# EAGLE design 8x8-LED-Matrix-No-Mode (EAGLE 5.11)
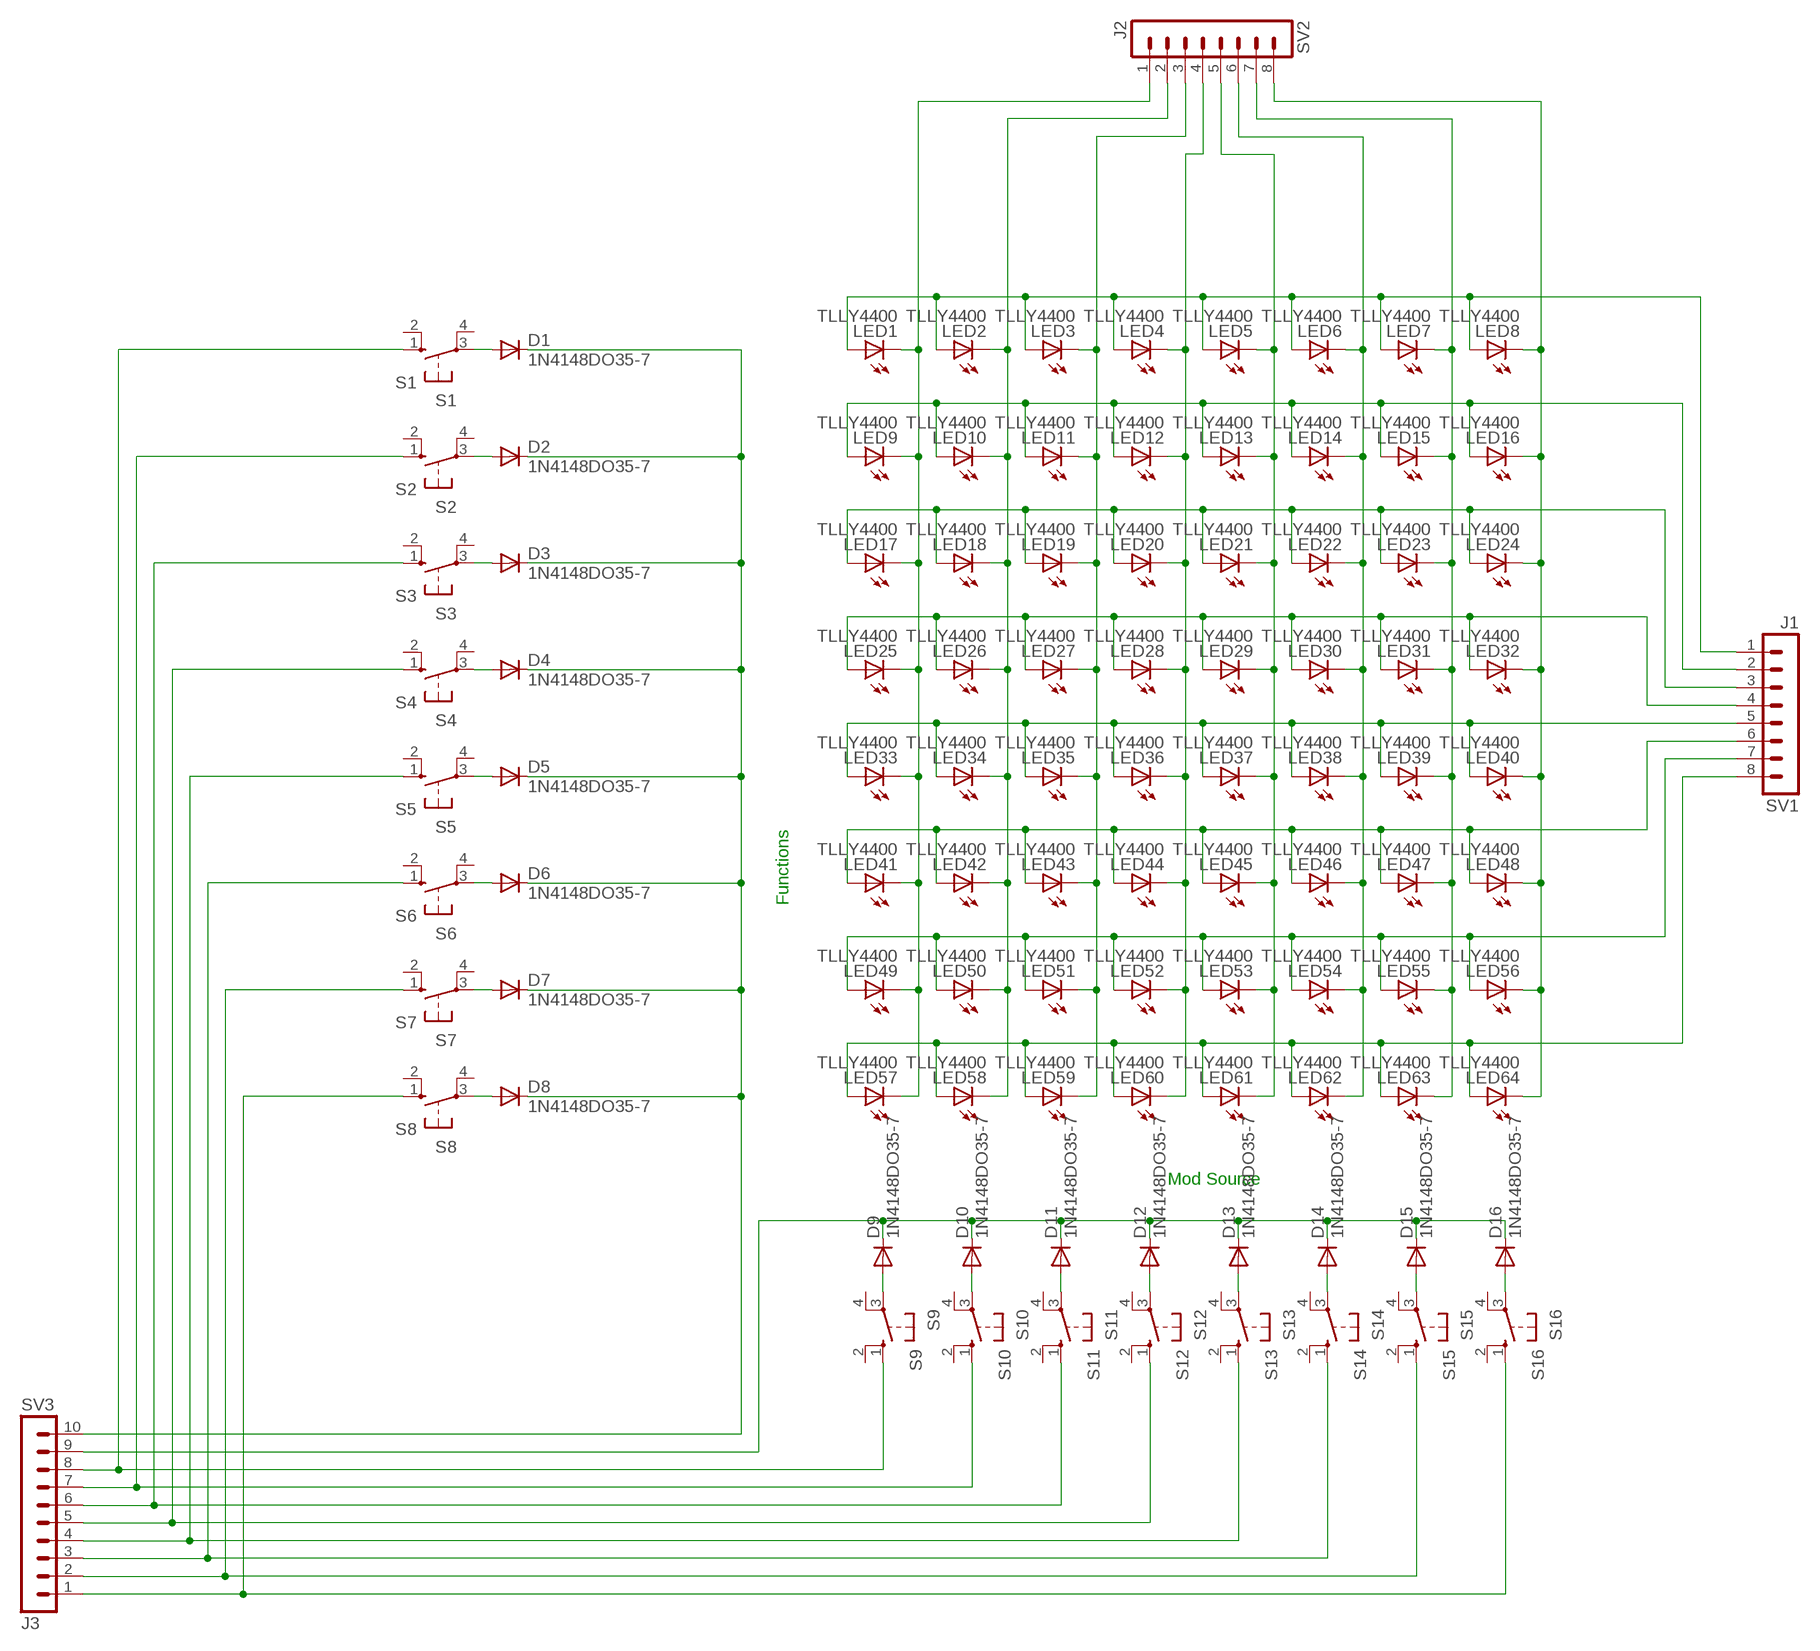
[diagram p0: schematic, sheet 1]

## Parts
D1  1N4148DO35-7  [DO35-7]
D2  1N4148DO35-7  [DO35-7]
D3  1N4148DO35-7  [DO35-7]
D4  1N4148DO35-7  [DO35-7]
D5  1N4148DO35-7  [DO35-7]
D6  1N4148DO35-7  [DO35-7]
D7  1N4148DO35-7  [DO35-7]
D8  1N4148DO35-7  [DO35-7]
D9  1N4148DO35-7  [DO35-7]
D10  1N4148DO35-7  [DO35-7]
D11  1N4148DO35-7  [DO35-7]
D12  1N4148DO35-7  [DO35-7]
D13  1N4148DO35-7  [DO35-7]
D14  1N4148DO35-7  [DO35-7]
D15  1N4148DO35-7  [DO35-7]
D16  1N4148DO35-7  [DO35-7]
LED1  TLLY4400  [LED3MM]
LED2  TLLY4400  [LED3MM]
LED3  TLLY4400  [LED3MM]
LED4  TLLY4400  [LED3MM]
LED5  TLLY4400  [LED3MM]
LED6  TLLY4400  [LED3MM]
LED7  TLLY4400  [LED3MM]
LED8  TLLY4400  [LED3MM]
LED9  TLLY4400  [LED3MM]
LED10  TLLY4400  [LED3MM]
LED11  TLLY4400  [LED3MM]
LED12  TLLY4400  [LED3MM]
LED13  TLLY4400  [LED3MM]
LED14  TLLY4400  [LED3MM]
LED15  TLLY4400  [LED3MM]
LED16  TLLY4400  [LED3MM]
LED17  TLLY4400  [LED3MM]
LED18  TLLY4400  [LED3MM]
LED19  TLLY4400  [LED3MM]
LED20  TLLY4400  [LED3MM]
LED21  TLLY4400  [LED3MM]
LED22  TLLY4400  [LED3MM]
LED23  TLLY4400  [LED3MM]
LED24  TLLY4400  [LED3MM]
LED25  TLLY4400  [LED3MM]
LED26  TLLY4400  [LED3MM]
LED27  TLLY4400  [LED3MM]
LED28  TLLY4400  [LED3MM]
LED29  TLLY4400  [LED3MM]
LED30  TLLY4400  [LED3MM]
LED31  TLLY4400  [LED3MM]
LED32  TLLY4400  [LED3MM]
LED33  TLLY4400  [LED3MM]
LED34  TLLY4400  [LED3MM]
LED35  TLLY4400  [LED3MM]
LED36  TLLY4400  [LED3MM]
LED37  TLLY4400  [LED3MM]
LED38  TLLY4400  [LED3MM]
LED39  TLLY4400  [LED3MM]
LED40  TLLY4400  [LED3MM]
LED41  TLLY4400  [LED3MM]
LED42  TLLY4400  [LED3MM]
LED43  TLLY4400  [LED3MM]
LED44  TLLY4400  [LED3MM]
LED45  TLLY4400  [LED3MM]
LED46  TLLY4400  [LED3MM]
LED47  TLLY4400  [LED3MM]
LED48  TLLY4400  [LED3MM]
LED49  TLLY4400  [LED3MM]
LED50  TLLY4400  [LED3MM]
LED51  TLLY4400  [LED3MM]
LED52  TLLY4400  [LED3MM]
LED53  TLLY4400  [LED3MM]
LED54  TLLY4400  [LED3MM]
LED55  TLLY4400  [LED3MM]
LED56  TLLY4400  [LED3MM]
LED57  TLLY4400  [LED3MM]
LED58  TLLY4400  [LED3MM]
LED59  TLLY4400  [LED3MM]
LED60  TLLY4400  [LED3MM]
LED61  TLLY4400  [LED3MM]
LED62  TLLY4400  [LED3MM]
LED63  TLLY4400  [LED3MM]
LED64  TLLY4400  [LED3MM]
S1  S1  10-XX  [B3F-10XX]
S2  S2  10-XX  [B3F-10XX]
S3  S3  10-XX  [B3F-10XX]
S4  S4  10-XX  [B3F-10XX]
S5  S5  10-XX  [B3F-10XX]
S6  S6  10-XX  [B3F-10XX]
S7  S7  10-XX  [B3F-10XX]
S8  S8  10-XX  [B3F-10XX]
S9  S9  10-XX  [B3F-10XX]
S10  S10  10-XX  [B3F-10XX]
S11  S11  10-XX  [B3F-10XX]
S12  S12  10-XX  [B3F-10XX]
S13  S13  10-XX  [B3F-10XX]
S14  S14  10-XX  [B3F-10XX]
S15  S15  10-XX  [B3F-10XX]
S16  S16  10-XX  [B3F-10XX]
SV1  J1  MA08-1  [MA08-1]
SV2  J2  MA08-1  [MA08-1]
SV3  J3  MA10-1  [MA10-1]

## Nets
N$1: LED1.A LED2.A LED3.A LED4.A LED5.A LED6.A LED7.A LED8.A SV1.1
N$2: LED9.A LED10.A LED11.A LED12.A LED13.A LED14.A LED15.A LED16.A SV1.2
N$3: LED17.A LED18.A LED19.A LED20.A LED21.A LED22.A LED23.A LED24.A SV1.3
N$4: LED25.A LED26.A LED27.A LED28.A LED29.A LED30.A LED31.A LED32.A SV1.4
N$5: LED33.A LED34.A LED35.A LED36.A LED37.A LED38.A LED39.A LED40.A SV1.5
N$6: LED41.A LED42.A LED43.A LED44.A LED45.A LED46.A LED47.A LED48.A SV1.6
N$7: D3.A S3.3(P)
N$8: LED57.A LED58.A LED59.A LED60.A LED61.A LED62.A LED63.A LED64.A SV1.8
N$9: LED1.K(C) LED9.K(C) LED17.K(C) LED25.K(C) LED33.K(C) LED41.K(C) LED49.K(C) LED57.K(C) SV2.1
N$10: LED2.K(C) LED10.K(C) LED18.K(C) LED26.K(C) LED34.K(C) LED42.K(C) LED50.K(C) LED58.K(C) SV2.2
N$11: LED3.K(C) LED11.K(C) LED19.K(C) LED27.K(C) LED35.K(C) LED43.K(C) LED51.K(C) LED59.K(C) SV2.3
N$12: LED4.K(C) LED12.K(C) LED20.K(C) LED28.K(C) LED36.K(C) LED44.K(C) LED52.K(C) LED60.K(C) SV2.4
N$13: LED5.K(C) LED13.K(C) LED21.K(C) LED29.K(C) LED37.K(C) LED45.K(C) LED53.K(C) LED61.K(C) SV2.5
N$14: LED6.K(C) LED14.K(C) LED22.K(C) LED30.K(C) LED38.K(C) LED46.K(C) LED54.K(C) LED62.K(C) SV2.6
N$15: LED7.K(C) LED15.K(C) LED23.K(C) LED31.K(C) LED39.K(C) LED47.K(C) LED55.K(C) LED63.K(C) SV2.7
N$16: LED8.K(C) LED16.K(C) LED24.K(C) LED32.K(C) LED40.K(C) LED48.K(C) LED56.K(C) LED64.K(C) SV2.8
N$17: LED49.A LED50.A LED51.A LED52.A LED53.A LED54.A LED55.A LED56.A SV1.7
N$18: S1.1(S) S9.1(S) SV3.8
N$19: S2.1(S) S10.1(S) SV3.7
N$20: S4.1(S) S12.1(S) SV3.5
N$21: S5.1(S) S13.1(S) SV3.4
N$22: S6.1(S) S14.1(S) SV3.3
N$23: S7.1(S) S15.1(S) SV3.2
N$24: S8.1(S) S16.1(S) SV3.1
N$25: S3.1(S) S11.1(S) SV3.6
N$26: D4.A S4.3(P)
N$27: D5.A S5.3(P)
N$28: D6.A S6.3(P)
N$29: D7.A S7.3(P)
N$30: D8.A S8.3(P)
N$31: D1.C D2.C D3.C D4.C D5.C D6.C D7.C D8.C SV3.10
N$32: D9.A S9.3(P)
N$33: D10.A S10.3(P)
N$38: D11.A S11.3(P)
N$39: D12.A S12.3(P)
N$40: D13.A S13.3(P)
N$41: D14.A S14.3(P)
N$42: D15.A S15.3(P)
N$43: D16.A S16.3(P)
N$44: D9.C D10.C D11.C D12.C D13.C D14.C D15.C D16.C SV3.9
N$48: D1.A S1.3(P)
N$49: D2.A S2.3(P)
Unconnected: S1.2(S1) S1.4(P1) S2.2(S1) S2.4(P1) S3.2(S1) S3.4(P1) S4.2(S1) S4.4(P1) S5.2(S1) S5.4(P1) S6.2(S1) S6.4(P1) S7.2(S1) S7.4(P1) S8.2(S1) S8.4(P1) S9.2(S1) S9.4(P1) S10.2(S1) S10.4(P1) S11.2(S1) S11.4(P1) S12.2(S1) S12.4(P1) S13.2(S1) S13.4(P1) S14.2(S1) S14.4(P1) S15.2(S1) S15.4(P1) S16.2(S1) S16.4(P1)

## Notes on the sheet
- Functions
- Mod Source

## Library data of the parts
D1-D16 = diode:1N4148: DIODE high speed (Philips)
LED1-LED64 = led:TLLY4400: Low Current (2mA) LED 3 mm Tinted Diffused Package color YELLOW Source: Data sheet <http://www.farnell.com/datasheets/391098.pdf>; MF: VISHAY SEMICONDUCTOR; OC_FARNELL: 1612439
S1-S16 = switch-omron:10-XX: OMRON SWITCH; MPN: B3F-1000; OC_FARNELL: 176432; OC_NEWARK: 36M3542
SV1 SV2 = con-lstb:MA08-1: PIN HEADER; OC_FARNELL: unknown; OC_NEWARK: unknown
SV3 = con-lstb:MA10-1: PIN HEADER; OC_FARNELL: unknown; OC_NEWARK: unknown

## Board
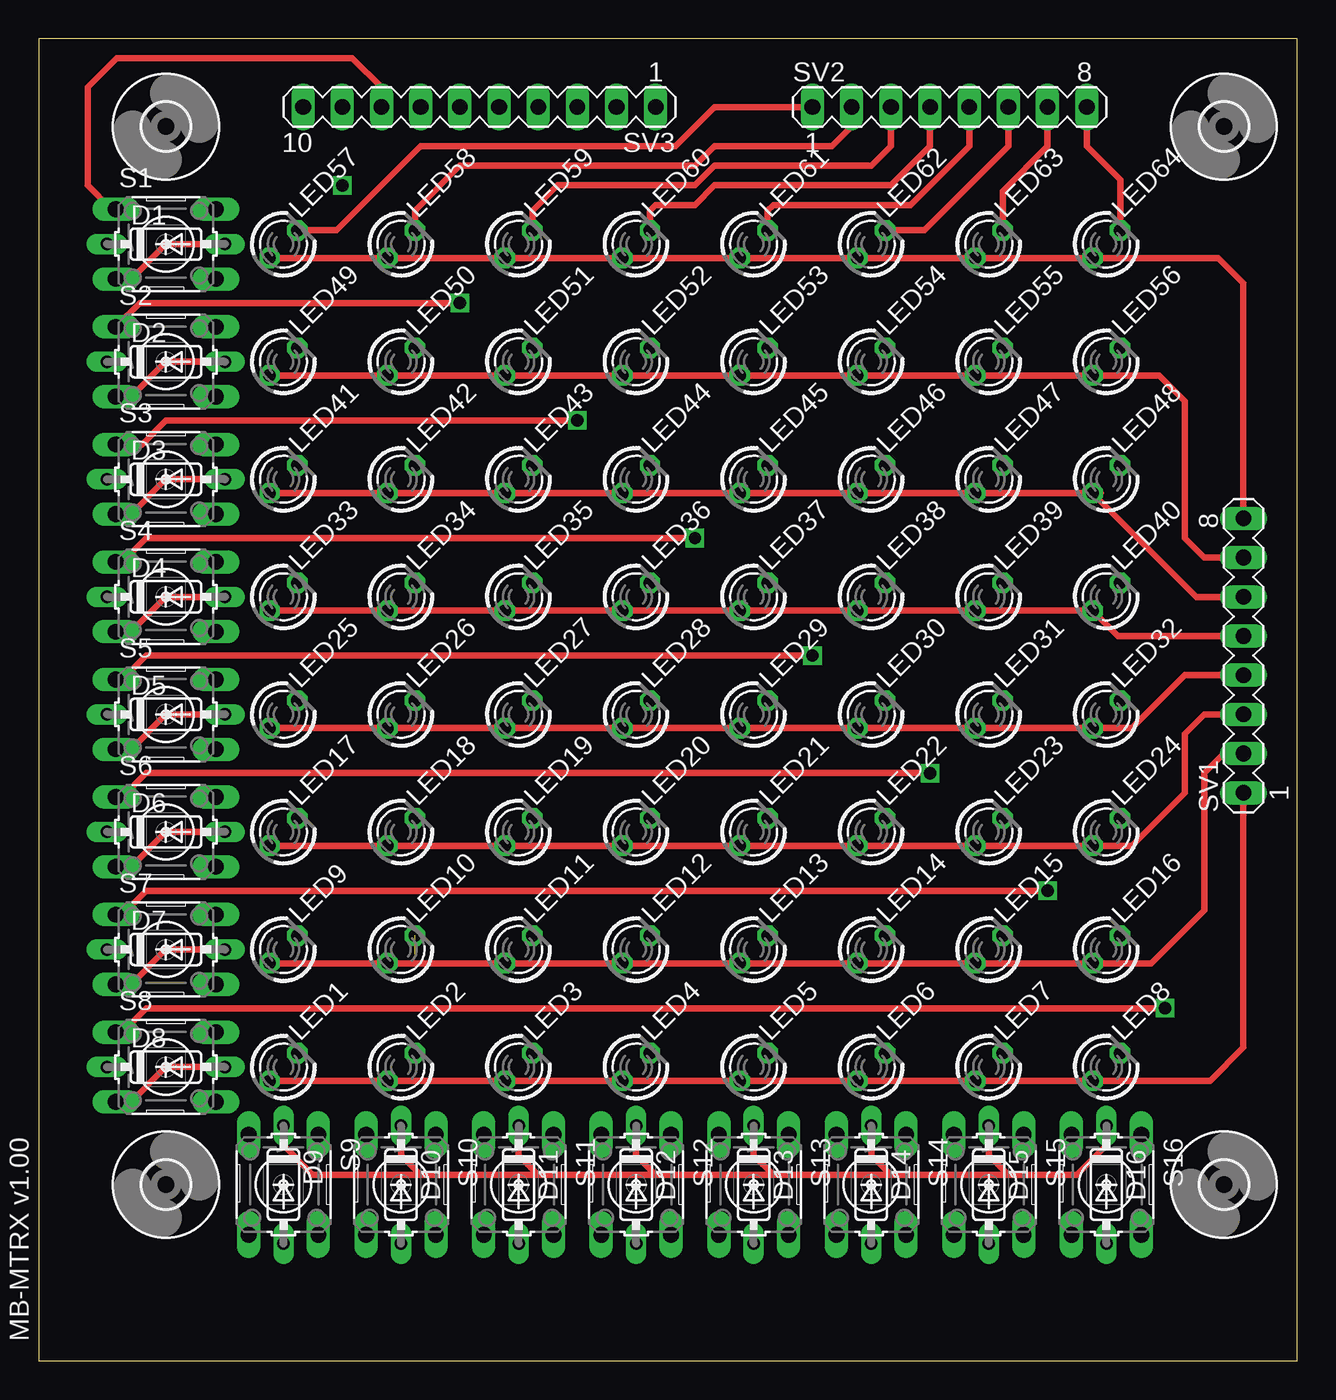
[diagram p1: board, top side]
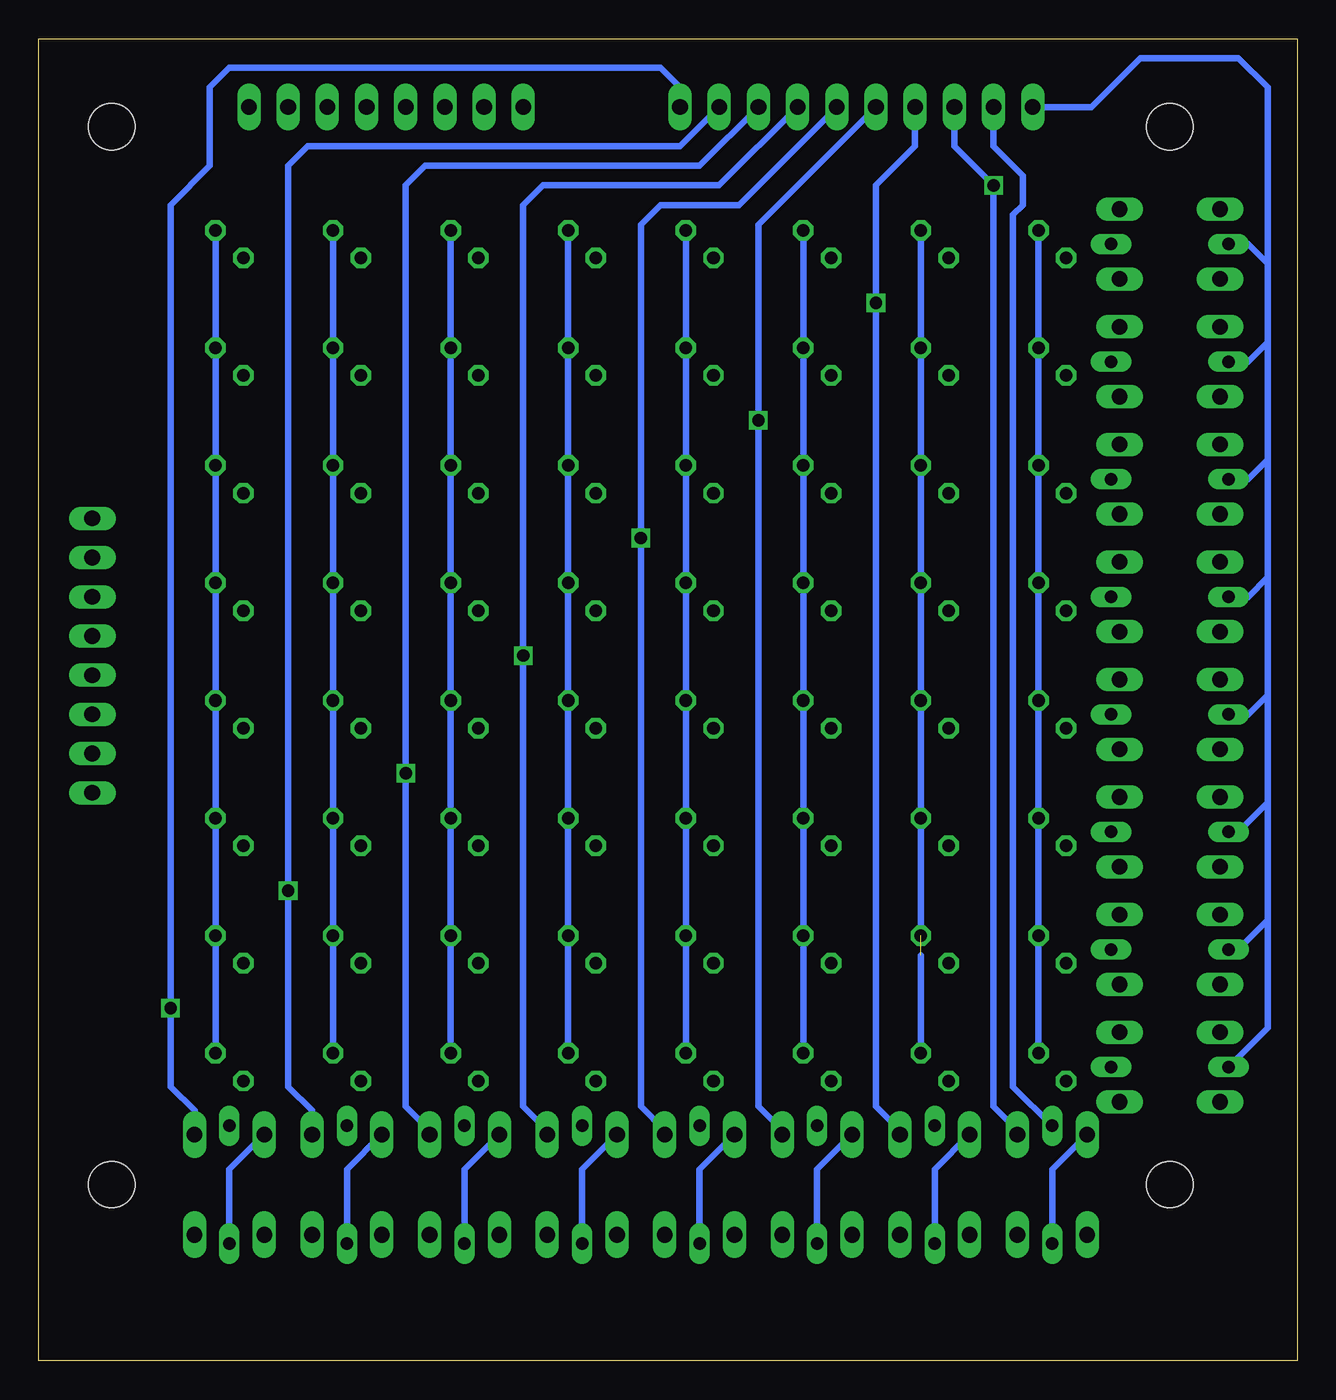
[diagram p2: board, bottom side, seen from below]

Size 81.59 x 85.72 mm. Coordinates in mm from the lower left corner, seen from the top.
Outline: 0,0 81.59,0 81.59,85.72 0,85.72 0,0
Copper layers (1*16): Top 0.035mm / dielectric 1.5mm / Bottom 0.035mm
Design rules "batchpcb": minimum track width 8mil, minimum drill 20mil, track to track 8mil, track to pad 8mil, pad to pad 8mil, via to via 8mil, smd to smd 8mil, copper to edge 40mil, drill to drill 8mil, minimum pad ring 10mil, minimum via ring 8mil, stop-mask expansion 4mil, vias tented up to drill 0mil, thermal gap 10mil

### Footprints (pad centres in the part's own frame; a part is rotated, then mirrored left to right if it is on the bottom)
DO35-7 = drill 0.813 long: A 3.81,0; C -3.81,0
LED3MM = drill 0.813 octagon: A -1.27,0; K 1.27,0
B3F-10XX = drill 1.016 long: 1 -3.251,2.261; 2 3.251,2.261; 3 -3.251,-2.261; 4 3.251,-2.261
MA08-1 = drill 1.016 long: 1 -8.89,0; 2 -6.35,0; 3 -3.81,0; 4 -1.27,0; 5 1.27,0; 6 3.81,0; 7 6.35,0; 8 8.89,0
MA10-1 = drill 1.016 long: 1 -11.43,0; 2 -8.89,0; 3 -6.35,0; 4 -3.81,0; 5 -1.27,0; 6 1.27,0; 7 3.81,0; 8 6.35,0; 9 8.89,0; 10 11.43,0
3,0 = hole 3: 0,0

### Placement (x,y rotation side)
D1  8.25,72.39 0 top
D2  8.25,64.77 0 top
D3  8.25,57.15 0 top
D4  8.25,49.53 0 top
D5  8.25,41.91 0 top
D6  8.25,34.29 0 top
D7  8.25,26.67 0 top
D8  8.25,19.05 0 top
D9  15.88,11.43 270 top
D10  23.5,11.43 270 top
D11  31.11,11.43 270 top
D12  38.73,11.43 270 top
D13  46.36,11.43 270 top
D14  53.98,11.43 270 top
D15  61.59,11.43 270 top
D16  69.22,11.43 270 top
LED1  15.88,19.05 45 top
LED2  23.5,19.05 45 top
LED3  31.11,19.05 45 top
LED4  38.73,19.05 45 top
LED5  46.36,19.05 45 top
LED6  53.98,19.05 45 top
LED7  61.59,19.05 45 top
LED8  69.22,19.05 45 top
LED9  15.88,26.67 45 top
LED10  23.5,26.67 45 top
LED11  31.11,26.67 45 top
LED12  38.73,26.67 45 top
LED13  46.36,26.67 45 top
LED14  53.98,26.67 45 top
LED15  61.59,26.67 45 top
LED16  69.22,26.67 45 top
LED17  15.88,34.29 45 top
LED18  23.5,34.29 45 top
LED19  31.11,34.29 45 top
LED20  38.73,34.29 45 top
LED21  46.36,34.29 45 top
LED22  53.98,34.29 45 top
LED23  61.59,34.29 45 top
LED24  69.22,34.29 45 top
LED25  15.88,41.91 45 top
LED26  23.5,41.91 45 top
LED27  31.11,41.91 45 top
LED28  38.73,41.91 45 top
LED29  46.36,41.91 45 top
LED30  53.98,41.91 45 top
LED31  61.59,41.91 45 top
LED32  69.22,41.91 45 top
LED33  15.88,49.53 45 top
LED34  23.5,49.53 45 top
LED35  31.11,49.53 45 top
LED36  38.73,49.53 45 top
LED37  46.36,49.53 45 top
LED38  53.98,49.53 45 top
LED39  61.59,49.53 45 top
LED40  69.22,49.53 45 top
LED41  15.88,57.15 45 top
LED42  23.5,57.15 45 top
LED43  31.11,57.15 45 top
LED44  38.73,57.15 45 top
LED45  46.36,57.15 45 top
LED46  53.98,57.15 45 top
LED47  61.59,57.15 45 top
LED48  69.22,57.15 45 top
LED49  15.88,64.77 45 top
LED50  23.5,64.77 45 top
LED51  31.11,64.77 45 top
LED52  38.73,64.77 45 top
LED53  46.36,64.77 45 top
LED54  53.98,64.77 45 top
LED55  61.59,64.77 45 top
LED56  69.22,64.77 45 top
LED57  15.88,72.39 45 top
LED58  23.5,72.39 45 top
LED59  31.11,72.39 45 top
LED60  38.73,72.39 45 top
LED61  46.36,72.39 45 top
LED62  53.98,72.39 45 top
LED63  61.59,72.39 45 top
LED64  69.22,72.39 45 top
S1  8.25,72.39 0 top
S2  8.25,64.77 0 top
S3  8.25,57.15 0 top
S4  8.25,49.53 0 top
S5  8.25,41.91 0 top
S6  8.25,34.29 0 top
S7  8.25,26.67 0 top
S8  8.25,19.05 0 top
S9  15.88,11.43 270 top
S10  23.5,11.43 270 top
S11  31.11,11.43 270 top
S12  38.73,11.43 270 top
S13  46.36,11.43 270 top
S14  53.98,11.43 270 top
S15  61.59,11.43 270 top
S16  69.22,11.43 270 top
SV1  78.11,45.72 90 top
SV2  59.05,81.28 0 top
SV3  28.57,81.28 180 top
U$1  [3,0]  8.25,80.01 0 top
U$2  [3,0]  76.84,80.01 0 top
U$3  [3,0]  76.84,11.43 0 top
U$4  [3,0]  8.25,11.43 0 top

### Tracks (layer width: path | path; a pad name or v marks a point on that pad's centre or on a via)
N$1
  Top 0.406: SV1.1 78.11,20.32 75.94,18.15 LED8.A LED7.A LED6.A LED5.A LED4.A LED3.A LED2.A LED1.A
N$2
  Top 0.406: SV1.2 76.84,39.37 75.56,38.1 75.56,29.21 72.13,25.77 LED16.A LED15.A LED14.A LED13.A LED12.A LED11.A LED10.A LED9.A
N$3
  Top 0.406: SV1.3 75.56,41.91 74.3,40.64 74.3,36.83 70.86,33.39 LED24.A LED23.A LED22.A LED21.A LED20.A LED19.A LED18.A LED17.A
N$4
  Top 0.406: SV1.4 74.3,44.45 70.86,41.01 LED32.A LED31.A LED30.A LED29.A LED28.A LED27.A LED26.A LED25.A
N$5
  Top 0.406: SV1.5 69.96,46.99 LED40.A LED39.A LED38.A LED37.A LED36.A LED35.A LED34.A LED33.A
N$6
  Top 0.406: LED48.A 68.84,56.25 | SV1.6 75.04,49.53 LED48.A | LED41.A LED42.A LED43.A LED44.A LED45.A LED46.A LED47.A LED48.A
N$7
  Top 0.406: S3.3 5.99,54.89 8.25,57.15 D3.A
N$8
  Top 0.406: LED57.A LED58.A LED59.A LED60.A LED61.A LED62.A LED63.A LED64.A 76.46,71.49 78.11,69.85 SV1.8
N$9
  Top 0.406: LED57.K 19.31,73.29 24.77,78.74 41.28,78.74 43.82,81.28 SV2.1
  Bottom 0.406: LED57.K LED49.K LED41.K LED33.K LED25.K LED17.K LED9.K LED1.K
N$10  (1 unrouted)
  Top 0.406: LED58.K 24.39,74.56 27.3,77.47 42.55,77.47 43.82,78.74 51.44,78.74 52.71,80.01 SV2.2
  Bottom 0.406: LED58.K LED50.K LED42.K LED34.K LED26.K LED18.K LED10.K | LED2.K 24.39,26.3
N$11
  Top 0.406: LED59.K 32.01,74.56 33.66,76.2 42.55,76.2 43.82,77.47 53.98,77.47 55.25,78.74 SV2.3
  Bottom 0.406: LED59.K LED51.K LED43.K LED35.K LED27.K LED19.K LED11.K LED3.K
N$12
  Top 0.406: LED60.K 39.63,74.56 40.01,74.93 42.55,74.93 43.82,76.2 55.25,76.2 57.79,78.74 SV2.4
  Bottom 0.406: LED60.K LED52.K LED44.K LED36.K LED28.K LED20.K LED12.K LED4.K
N$13
  Top 0.406: LED61.K 47.25,74.56 47.62,74.93 56.52,74.93 60.33,78.74 SV2.5
  Bottom 0.406: LED61.K LED53.K LED45.K LED37.K LED29.K LED21.K LED13.K LED5.K
N$14
  Top 0.406: LED62.K 57.41,73.29 62.87,78.74 SV2.6
  Bottom 0.406: LED62.K LED54.K LED46.K LED38.K LED30.K LED22.K LED14.K LED6.K
N$15
  Top 0.406: LED63.K 62.49,75.83 65.41,78.74 SV2.7
  Bottom 0.406: LED63.K LED55.K LED47.K LED39.K LED31.K LED23.K LED15.K LED7.K
N$16
  Top 0.406: LED64.K 70.11,76.57 67.95,78.74 SV2.8
  Bottom 0.406: LED64.K LED56.K LED48.K LED40.K LED32.K LED24.K LED16.K LED8.K
N$17
  Top 0.406: SV1.7 75.56,52.07 74.3,53.34 74.3,62.23 72.65,63.87 LED56.A LED55.A LED54.A LED53.A LED52.A LED51.A LED50.A LED49.A
N$18  (via drill 0.8)
  Top 0.406: S1.1 4.72,74.65 3.17,76.2 3.17,82.55 5.08,84.45 20.32,84.45 22.22,82.55 SV3.8
  Bottom 0.406: S9.1 18.14,14.96 19.68,16.51 v19.68,76.2 22.22,78.74 SV3.8
N$19  (via drill 0.8)
  Top 0.406: v27.3,68.58 6.55,68.58 S2.1
  Bottom 0.406: S10.1 25.76,14.96 27.3,16.51 v27.3,68.58 27.3,76.2 24.77,78.74 SV3.7
N$20  (via drill 0.8)
  Top 0.406: S4.1 5.44,51.79 6.99,53.34 v42.55,53.34
  Bottom 0.406: S12.1 41,14.96 42.55,16.51 v42.55,53.34 42.55,73.66 41.28,74.93 36.2,74.93 SV3.5
N$21  (via drill 0.8)
  Top 0.406: S5.1 5.44,44.17 6.99,45.72 v50.17,45.72
  Bottom 0.406: S13.1 48.62,14.96 50.17,16.51 v50.17,45.72 50.17,74.93 48.9,76.2 37.47,76.2 SV3.4
N$22  (via drill 0.8)
  Top 0.406: S6.1 5.44,36.55 6.99,38.1 v57.79,38.1
  Bottom 0.406: S14.1 56.24,14.96 57.79,16.51 v57.79,38.1 57.79,76.2 56.52,77.47 38.73,77.47 SV3.3
N$23  (via drill 0.8)
  Top 0.406: S7.1 5.44,28.93 6.99,30.48 v65.41,30.48
  Bottom 0.406: S15.1 63.86,16.23 65.41,17.78 v65.41,30.48 65.41,77.47 64.14,78.74 40.01,78.74 SV3.2
N$24  (via drill 0.8)
  Top 0.406: S8.1 5.44,21.31 6.99,22.86 v73.03,22.86
  Bottom 0.406: S16.1 71.48,16.23 73.03,17.78 v73.03,22.86 73.03,74.93 70.48,77.47 70.48,82.55 69.22,83.82 41.28,83.82 40.01,82.55 SV3.1
N$25  (via drill 0.8)
  Top 0.406: S3.1 6.71,59.41 8.25,60.96 v34.93,60.96
  Bottom 0.406: S11.1 33.38,14.96 34.93,16.51 v34.93,60.96 34.93,73.66 SV3.6
N$26
  Top 0.406: S4.3 5.99,47.27 8.25,49.53 D4.A
N$27
  Top 0.406: S5.3 5.99,39.65 8.25,41.91 D5.A
N$28
  Top 0.406: S6.3 5.99,32.03 8.25,34.29 D6.A
N$29
  Top 0.406: S7.3 5.99,24.41 8.25,26.67 D7.A
N$30
  Top 0.406: S8.3 5.99,16.79 8.25,19.05 D8.A
N$31
  Bottom 0.406: D1.C 3.17,72.39 1.91,71.12 | 1.91,28.57 1.91,21.59 D8.C | 1.91,28.57 1.91,36.2 | 1.91,36.2 1.91,43.18 | 1.91,43.18 1.91,50.8 | 1.91,50.8 1.91,58.42 | 1.91,58.42 1.91,66.04 | 1.91,66.04 1.91,70.48 1.91,71.12 | D7.C 3.81,26.67 1.91,28.57 | D6.C 3.81,34.29 1.91,36.2 | D5.C 3.17,41.91 1.91,43.18 | D4.C 3.17,49.53 1.91,50.8 | D3.C 3.17,57.15 1.91,58.42 | D2.C 3.17,64.77 1.91,66.04 | SV3.10 13.34,81.28 10.16,84.45 3.81,84.45 1.91,82.55 1.91,71.12
N$32
  Bottom 0.406: D9.A 15.88,12.42 S9.3
N$33
  Bottom 0.406: D10.A 23.5,12.42 S10.3
N$38
  Bottom 0.406: D11.A 31.11,12.42 S11.3
N$39
  Bottom 0.406: D12.A 38.73,12.42 S12.3
N$40
  Bottom 0.406: D13.A 46.36,12.42 S13.3
N$41
  Bottom 0.406: D14.A 53.98,12.42 S14.3
N$42
  Bottom 0.406: D15.A 61.59,12.42 S15.3
N$43
  Bottom 0.406: D16.A 69.22,12.42 S16.3
N$44
  Top 0.406: D9.C 15.88,13.97 17.78,12.06 24.77,12.06 | 24.77,12.06 32.39,12.06 | 32.39,12.06 40.01,12.06 | 40.01,12.06 47.62,12.06 | 47.62,12.06 55.25,12.06 | 55.25,12.06 62.87,12.06 | 62.87,12.06 67.31,12.06 69.22,13.97 D16.C | D15.C 61.59,13.34 62.87,12.06 | D14.C 53.98,13.34 55.25,12.06 | D13.C 46.36,13.34 47.62,12.06 | D12.C 38.73,13.34 40.01,12.06 | D11.C 31.11,13.34 32.39,12.06 | D10.C 23.5,13.34 24.77,12.06
  Bottom 0.406: SV3.9 19.68,78.74 17.78,76.83 17.78,74.93 18.41,74.3 18.41,17.78 D9.C
N$48
  Top 0.406: S1.3 5.99,70.13 8.25,72.39 D1.A
N$49
  Top 0.406: S2.3 5.99,62.51 8.25,64.77 D2.A

### Text on the board
tNames: MB-MTRX v1.00